# Altium project nrf52-DK.PrjPcb
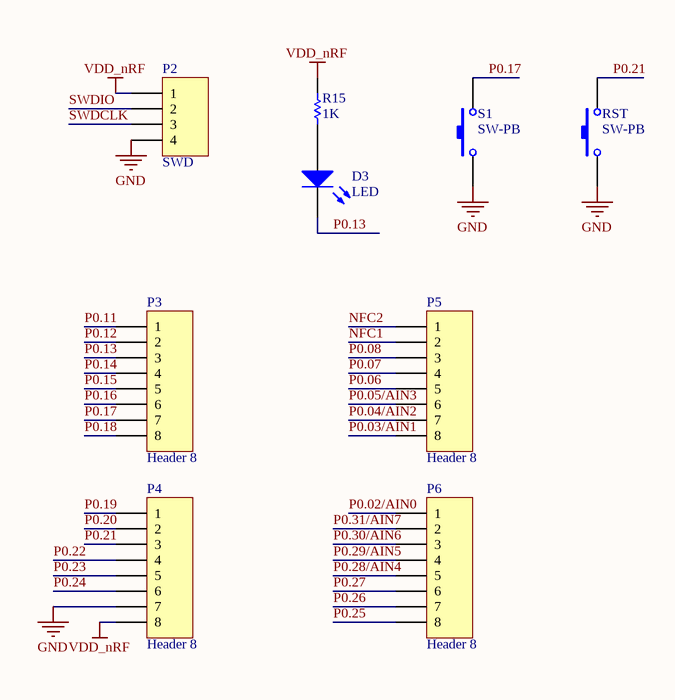
[diagram p0: connect.SchDoc]
2 sheets, 48 parts. Net scope: global (net labels, ports and power ports of the same name join across sheets).
Board files: nrf52832_qfax_nfc.PcbDoc, array.PcbDoc
Sheets:
  connect.SchDoc
  jlink_ob.SchDoc

## Sheet connect.SchDoc
size A4

### Parts
D3  LED  [0603]
P2  SWD  [HDR1X4]
P3  Header 8  [HDR1X8]
P4  Header 8  [HDR1X8]
P5  Header 8  [HDR1X8]
P6  Header 8  [HDR1X8]
R15  value 1K  [R0603-M]  (hidden comment: Resistors SMD)
RST  SW-PB  [SWITCH_SMD_4x3_DHT-1185]
S1  SW-PB  [SWITCH_SMD_4x3_DHT-1185]

### Nets
GND: P2.4 P4.7 RST.1 S1.1
VDD_nRF: P2.1 P4.8 R15.1
NFC1: P5.2
NFC2: P5.1
P0.02/AIN0: P6.1
P0.03/AIN1: P5.8
P0.04/AIN2: P5.7
P0.05/AIN3: P5.6
P0.06: P5.5
P0.07: P5.4
P0.08: P5.3
P0.11: P3.1
P0.12: P3.2
P0.13: D3.2(K) P3.3
P0.14: P3.4
P0.15: P3.5
P0.16: P3.6
P0.17: P3.7 S1.2
P0.18: P3.8
P0.19: P4.1
P0.20: P4.2
P0.21: P4.3 RST.2
P0.22: P4.4
P0.23: P4.5
P0.24: P4.6
P0.25: P6.8
P0.26: P6.7
P0.27: P6.6
P0.28/AIN4: P6.5
P0.29/AIN5: P6.4
P0.30/AIN6: P6.3
P0.31/AIN7: P6.2
SWDCLK: P2.3
SWDIO: P2.2
NetD3_1: D3.1(A) R15.2

### Library data of the parts
D3 = LED: Typical INFRARED GaAs LED; Published: 8-Jun-2000; LatestRevisionDate: 08-Jul-2005; LatestRevisionNote: Mech Layer 1 removed.; PackageReference: LED-0; Publisher: Altium Limited; PackageDescription: LED; 2 Leads
P2 = Header 4: Header, 4-Pin; LatestRevisionDate: 17-Jul-2002; LatestRevisionNote: Re-released for DXP Platform.; Publisher: Altium Limited
P3-P6 = Header 8: Header, 8-Pin; LatestRevisionDate: 17-Jul-2002; LatestRevisionNote: Re-released for DXP Platform.; Publisher: Altium Limited
R15 = Resistors SMD: Resistor
RST S1 = SW-PB: Switch; Published: 24-Mar-1999; LatestRevisionDate: 17-Jul-2002; LatestRevisionNote: Re-released for DXP Platform.; PackageReference: SPST-2; Publisher: Altium Limited; PackageDescription: Switch; 2 Leads

## Sheet jlink_ob.SchDoc
size A4
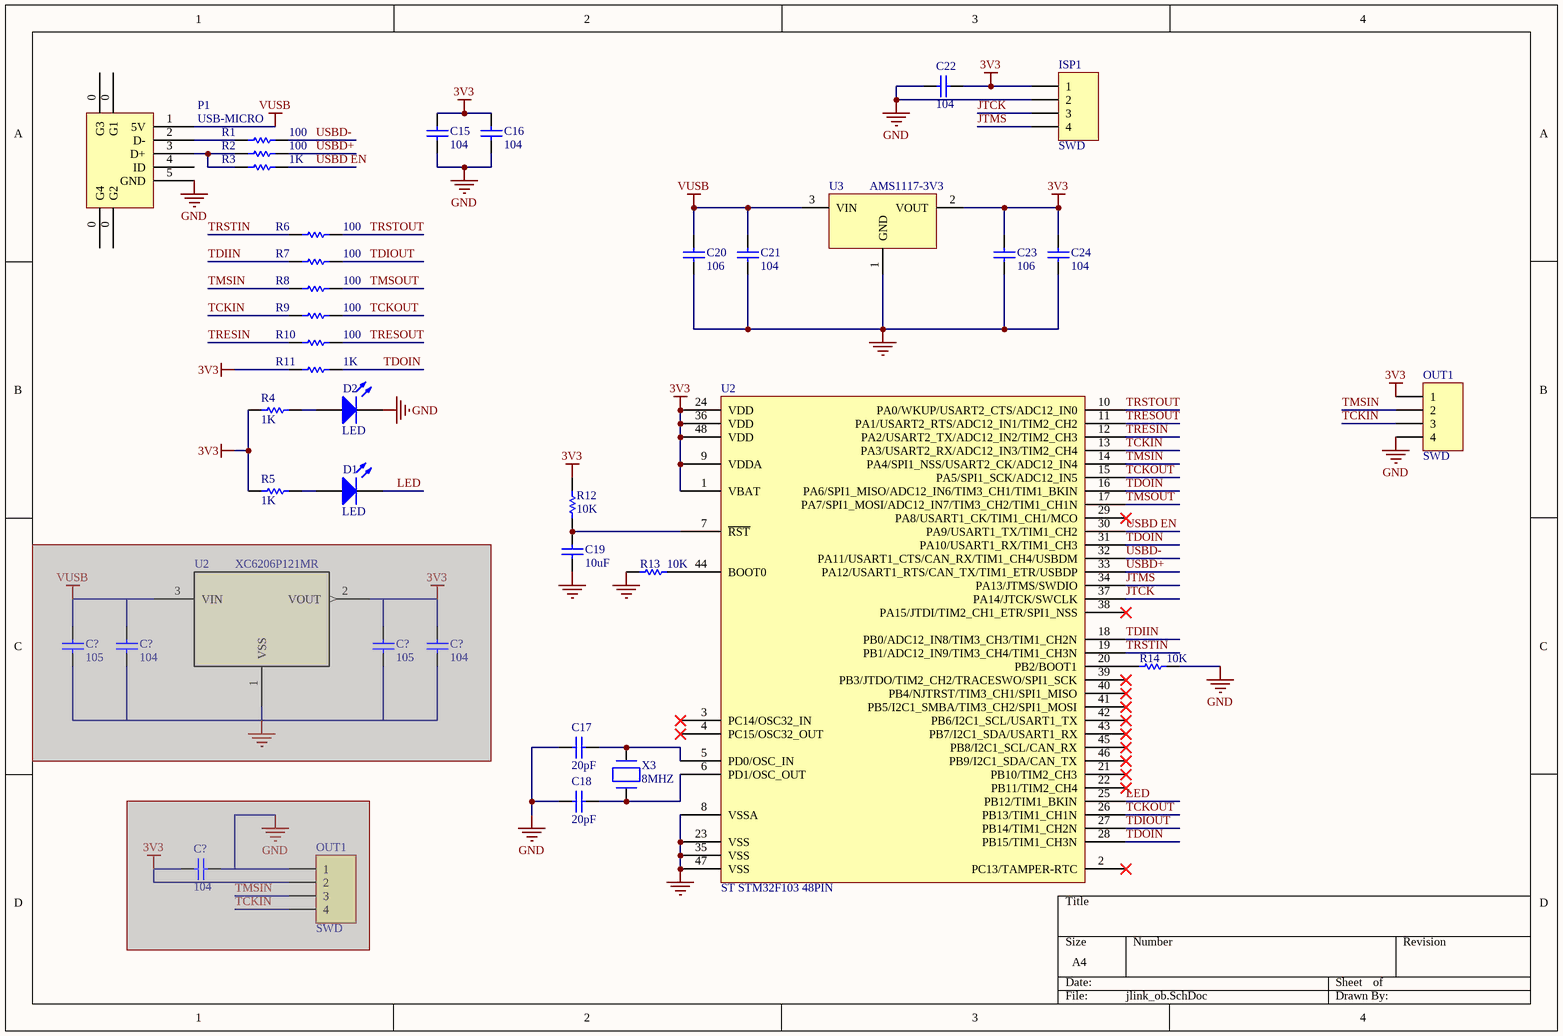
[diagram p1: jlink_ob.SchDoc]

### Parts
(Parts that share a designator on the sheet are numbered #1, #2 ... from top to bottom, then left to right.)
C15  value 104  [C0603]  (hidden comment: Cap Semi)
C16  value 104  [C0603]  (hidden comment: Cap Semi)
C17  value 20pF  [C0603]  (hidden comment: Cap Semi)
C18  value 20pF  [C0603]  (hidden comment: Cap Semi)
C19  value 10uF  [C0603]  (hidden comment: Cap Semi)
C20  value 106  [C0603]  (hidden comment: Cap Semi)
C21  value 104  [C0603]  (hidden comment: Cap Semi)
C22  value 104  [C0603]  (hidden comment: Cap Semi)
C23  value 106  [C0603]  (hidden comment: Cap Semi)
C24  value 104  [C0603]  (hidden comment: Cap Semi)
C?#1  value 104  [C0603]  (hidden comment: Cap Semi)  (masked out: inside a compile mask, not in the netlist)
C?#2  value 104  [C0603]  (hidden comment: Cap Semi)  (masked out: inside a compile mask, not in the netlist)
C?#3  value 105  [C0603]  (hidden comment: Cap Semi)  (masked out: inside a compile mask, not in the netlist)
C?#4  value 105  [C0603]  (hidden comment: Cap Semi)  (masked out: inside a compile mask, not in the netlist)
C?#5  value 104  [C0603]  (hidden comment: Cap Semi)  (masked out: inside a compile mask, not in the netlist)
D1  LED  [0603]
D2  LED  [0603]
ISP1  SWD  [HDR1X4]
OUT1#1  SWD  [HDR1X4]
OUT1#2  SWD  [HDR1X4]  (masked out: inside a compile mask, not in the netlist)
P1  USB-MICRO  [USB-MICRO]
R1  value 100  [R0603-M]  (hidden comment: Resistors SMD)
R2  value 100  [R0603-M]  (hidden comment: Resistors SMD)
R3  value 1K  [R0603-M]  (hidden comment: Resistors SMD)
R4  value 1K  [R0603-M]  (hidden comment: Resistors SMD)
R5  value 1K  [R0603-M]  (hidden comment: Resistors SMD)
R6  value 100  [R0603-M]  (hidden comment: Resistors SMD)
R7  value 100  [R0603-M]  (hidden comment: Resistors SMD)
R8  value 100  [R0603-M]  (hidden comment: Resistors SMD)
R9  value 100  [R0603-M]  (hidden comment: Resistors SMD)
R10  value 100  [R0603-M]  (hidden comment: Resistors SMD)
R11  value 1K  [R0603-M]  (hidden comment: Resistors SMD)
R12  value 10K  [R0603-M]  (hidden comment: Resistors SMD)
R13  value 10K  [R0603-M]  (hidden comment: Resistors SMD)
R14  value 10K  [R0603-M]  (hidden comment: Resistors SMD)
U2#1  XC6206P121MR  [SOT-23]  (masked out: inside a compile mask, not in the netlist)
U2#2  ST STM32F103 48PIN  [ST LQFP-48 7x7MM]
U3  AMS1117-3V3  [SOT-223]
X3  8MHZ  [XTAL_ABLS2_ABR]

### Nets
3V3: C15.2 C16.2 C22.1 C23.2 C24.1 ISP1.1 OUT1#1.1 R4.2 R5.2 R11.2 R12.2 U2#2.1(VBAT) U2#2.9(VDDA) U2#2.24(VDD) U2#2.36(VDD) U2#2.48(VDD) U3.2(VOUT)
GND: C15.1 C16.1 C17.2 C18.2 C19.1 C20.1 C21.2 C22.2 C23.1 C24.2 D2.2(K) ISP1.2 OUT1#1.4 P1.5(GND) R13.1 R14.2 U2#2.8(VSSA) U2#2.23(VSS) U2#2.35(VSS) U2#2.47(VSS) U3.1(GND)
VUSB: C20.2 C21.1 P1.1(5V) U3.3(VIN)
JTCK: ISP1.3 U2#2.37(PA14/JTCK/SWCLK)
JTMS: ISP1.4 U2#2.34(PA13/JTMS/SWDIO)
LED: D1.2(K) U2#2.25(PB12/TIM1_BKIN)
TCKIN: OUT1#1.3 R9.1 U2#2.13(PA3/USART2_RX/ADC12_IN3/TIM2_CH4)
TCKOUT: R9.2 U2#2.15(PA5/SPI1_SCK/ADC12_IN5) U2#2.26(PB13/TIM1_CH1N)
TDIIN: R7.1 U2#2.18(PB0/ADC12_IN8/TIM3_CH3/TIM1_CH2N)
TDIOUT: R7.2 U2#2.27(PB14/TIM1_CH2N)
TDOIN: R11.1 U2#2.16(PA6/SPI1_MISO/ADC12_IN6/TIM3_CH1/TIM1_BKIN) U2#2.28(PB15/TIM1_CH3N) U2#2.31(PA10/USART1_RX/TIM1_CH3)
TMSIN: OUT1#1.2 R8.1 U2#2.14(PA4/SPI1_NSS/USART2_CK/ADC12_IN4)
TMSOUT: R8.2 U2#2.17(PA7/SPI1_MOSI/ADC12_IN7/TIM3_CH2/TIM1_CH1N)
TRESIN: R10.1 U2#2.12(PA2/USART2_TX/ADC12_IN2/TIM2_CH3)
TRESOUT: R10.2 U2#2.11(PA1/USART2_RTS/ADC12_IN1/TIM2_CH2)
TRSTIN: R6.1 U2#2.19(PB1/ADC12_IN9/TIM3_CH4/TIM1_CH3N)
TRSTOUT: R6.2 U2#2.10(PA0/WKUP/USART2_CTS/ADC12_IN0)
USBD EN: R3.2 U2#2.30(PA9/USART1_TX/TIM1_CH2)
USBD+: R2.2 U2#2.33(PA12/USART1_RTS/CAN_TX/TIM1_ETR/USBDP)
USBD-: R1.2 U2#2.32(PA11/USART1_CTS/CAN_RX/TIM1_CH4/USBDM)
NetC17_1: C17.1 U2#2.5(PD0/OSC_IN) X3.2
NetC18_1: C18.1 U2#2.6(PD1/OSC_OUT) X3.1
NetC19_2: C19.2 R12.1 U2#2.7(~{RST})
NetD1_1: D1.1(A) R5.1
NetD2_1: D2.1(A) R4.1
NetP1_2: P1.2(D-) R1.1
NetP1_3: P1.3(D+) R2.1 R3.1
NetR13_2: R13.2 U2#2.44(BOOT0)
NetR14_1: R14.1 U2#2.20(PB2/BOOT1)

Not connected (* = marked no-connect by the designer): P1 0(G1) 4(ID); U2#2 2(PC13/TAMPER-RTC)* 3(PC14/OSC32_IN)* 4(PC15/OSC32_OUT)* 21(PB10/TIM2_CH3)* 22(PB11/TIM2_CH4)* 29(PA8/USART1_CK/TIM1_CH1/MCO)* 38(PA15/JTDI/TIM2_CH1_ETR/SPI1_NSS)* 39(PB3/JTDO/TIM2_CH2/TRACESWO/SPI1_SCK)* 40(PB4/NJTRST/TIM3_CH1/SPI1_MISO)* 41(PB5/I2C1_SMBA/TIM3_CH2/SPI1_MOSI)* 42(PB6/I2C1_SCL/USART1_TX)* 43(PB7/I2C1_SDA/USART1_RX)* 45(PB8/I2C1_SCL/CAN_RX)* 46(PB9/I2C1_SDA/CAN_TX)*

### Library data of the parts
C15-C24 C?#1-C?#5 = Cap Semi: Capacitor (Semiconductor SIM Model); Published: 8-Jun-2000; LatestRevisionDate: 29-May-2009; LatestRevisionNote: IPC-7351 Footprint Added.; PackageReference: C1206; Publisher: Altium Limited; PackageDescription: Chip Capacitor
D1 D2 = LED: Typical INFRARED GaAs LED; Published: 8-Jun-2000; LatestRevisionDate: 08-Jul-2005; LatestRevisionNote: Mech Layer 1 removed.; PackageReference: LED-0; Publisher: Altium Limited; PackageDescription: LED; 2 Leads
ISP1 OUT1#1 OUT1#2 = Header 4: Header, 4-Pin; LatestRevisionDate: 17-Jul-2002; LatestRevisionNote: Re-released for DXP Platform.; Publisher: Altium Limited
R1-R14 = Resistors SMD: Resistor
U2#1 = XC6206P121MR: Imported; Vendor: Torex Semiconductor; Built_By: EMA_UL_Team; C: Copyright (C) 2016 Accelerated Designs. All rights reserved; Manufacturer_Part_Number: XC6206P121MR; RefDes: RefDes; Type: DEV; Value: Value
U3 = AMS1117
X3 = crystal: No Description Available; Manufacturer_Part_Number: ABLS-8.000MHZ-B4-T; Built_By: EMA_Matt; Vendor: Abracon; SourceLibrary: Abracon_10-11-2019; Copyright: Copyright (C) 2018 Accelerated Designs. All rights reserved; RefDes: RefDes; Type: Type

## Nets that join several sheets
GND: connect (P2.4 P4.7 RST.1 S1.1), jlink_ob (21 pins)